# EAGLE design ROB (EAGLE 9.6.2)
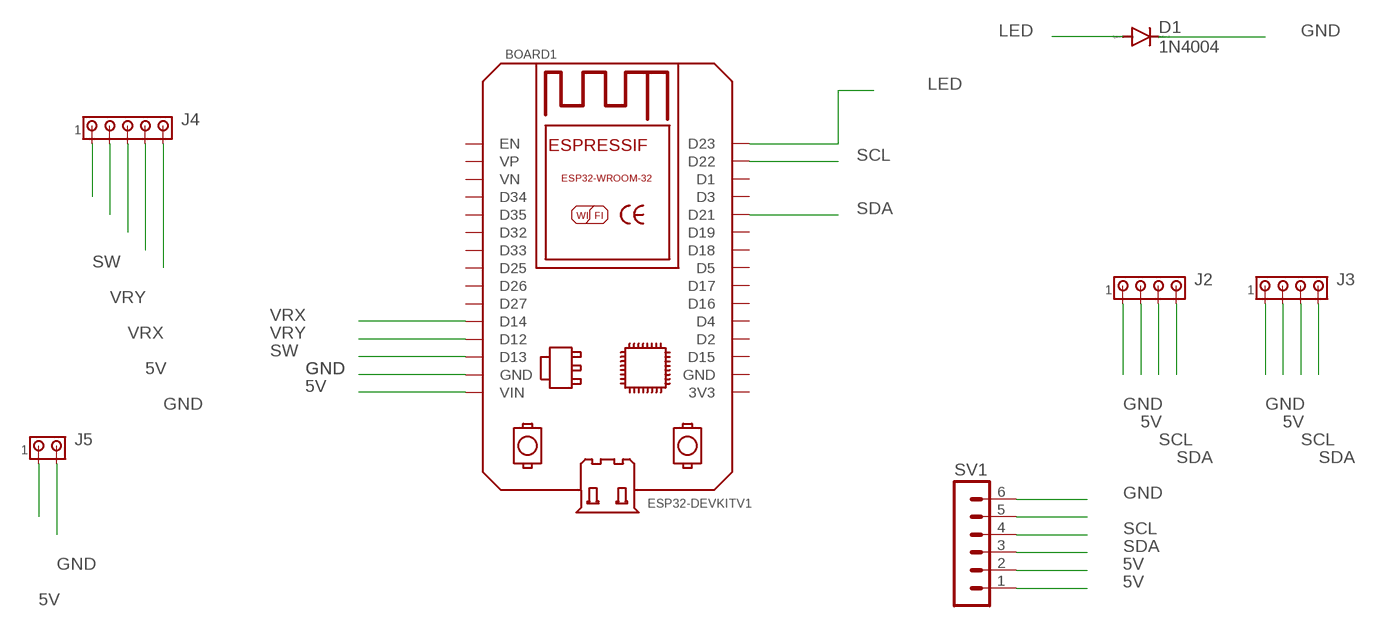
[diagram p0: schematic, sheet 1]

## Parts
BOARD1  ESP32DEVKITV1  [ESP32-DEVKITV1]
D1  1N4004  [DO41-10]
J2  MTA04-100  [10X04MTA]
J3  MTA04-100  [10X04MTA]
J4  MTA05-100  [10X05MTA]
J5  MTA02-156  [1X2MTA]
SV1  MA06-1  [MA06-1]

## Nets
5V: BOARD1.VIN J2.2 J3.2 J4.4 J5.1 SV1.1 SV1.2
GND: BOARD1.GND D1.C J2.1 J3.1 J4.5 J5.2 SV1.6
LED: BOARD1.D23 D1.A
N$2: SV1.5
SCL: BOARD1.D22 J2.3 J3.3 SV1.4
SDA: BOARD1.D21 J2.4 J3.4 SV1.3
SW: BOARD1.D13 J4.1
VRX: BOARD1.D14 J4.3
VRY: BOARD1.D12 J4.2
Unconnected: BOARD1.3V3 BOARD1.D1 BOARD1.D2 BOARD1.D3 BOARD1.D4 BOARD1.D5 BOARD1.D15 BOARD1.D16 BOARD1.D17 BOARD1.D18 BOARD1.D19 BOARD1.D25 BOARD1.D26 BOARD1.D27 BOARD1.D32 BOARD1.D33 BOARD1.D34 BOARD1.D35 BOARD1.EN BOARD1.GND@1(GND) BOARD1.VN BOARD1.VP

## Library data of the parts
BOARD1 = ESP32-DEVKITV1:ESP32DEVKITV1: https://github.com/shridattdudhat
D1 = diode:1N4004: DIODE general purpose rectifier, 1 A
J2 J3 = con-amp:MTA04-100: AMP connector
J4 = con-amp:MTA05-100: AMP connector
J5 = con-amp:MTA02-156: AMP connector
SV1 = con-lstb:MA06-1: PIN HEADER; OC_FARNELL: unknown; OC_NEWARK: unknown

## Board
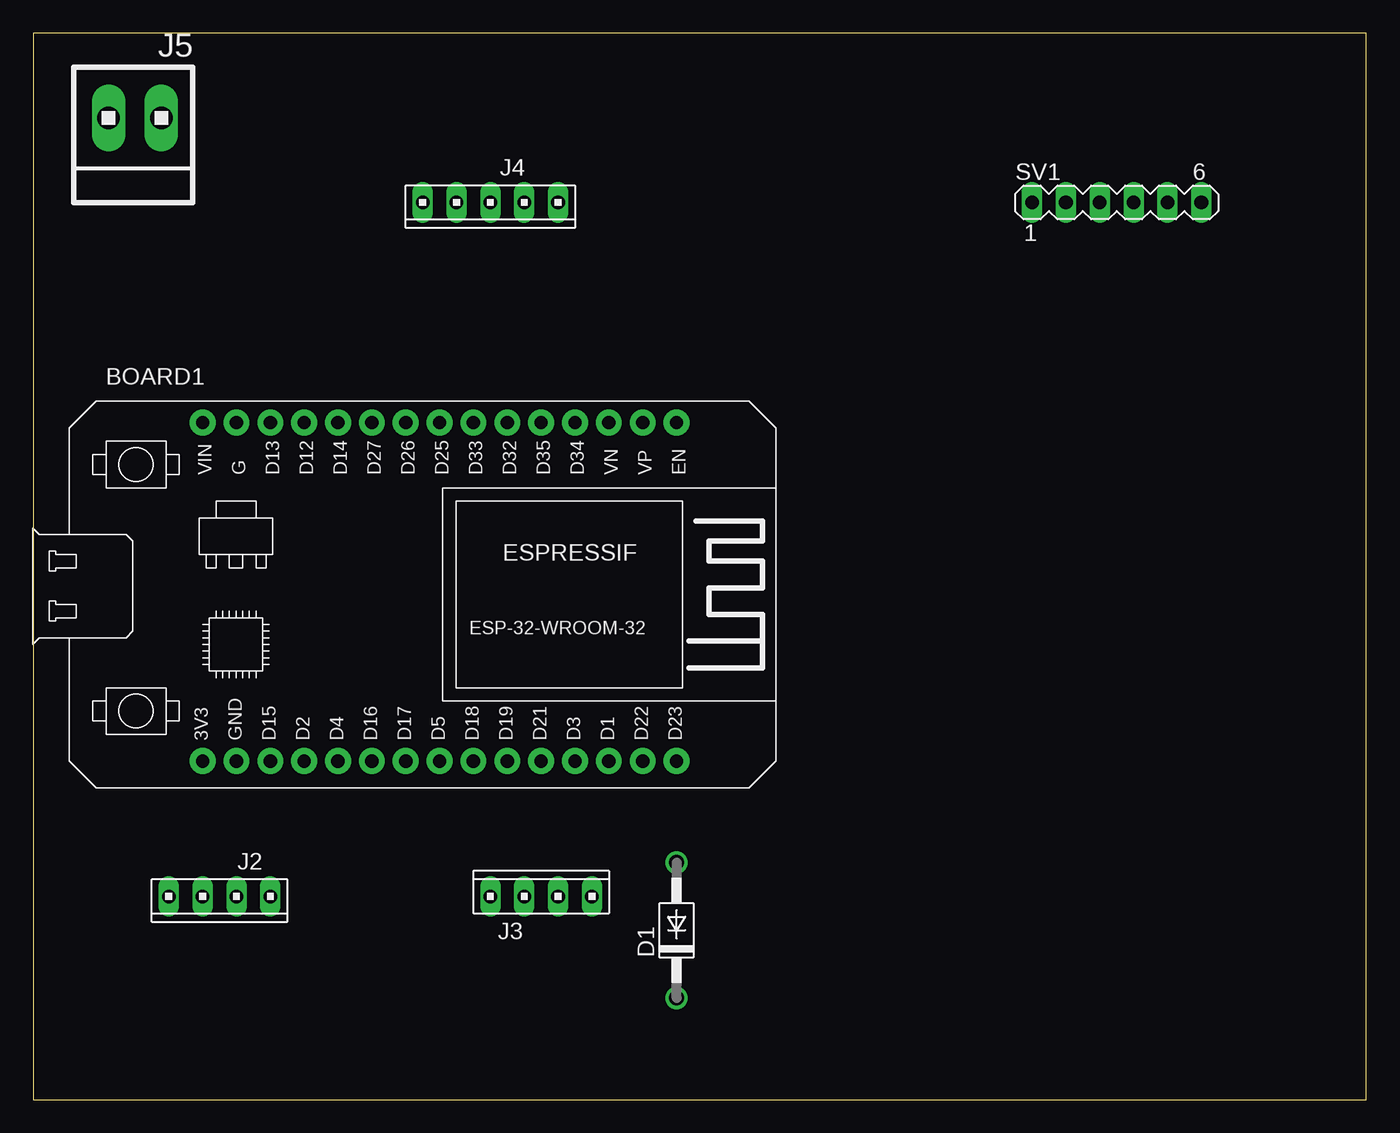
[diagram p1: board, top side]
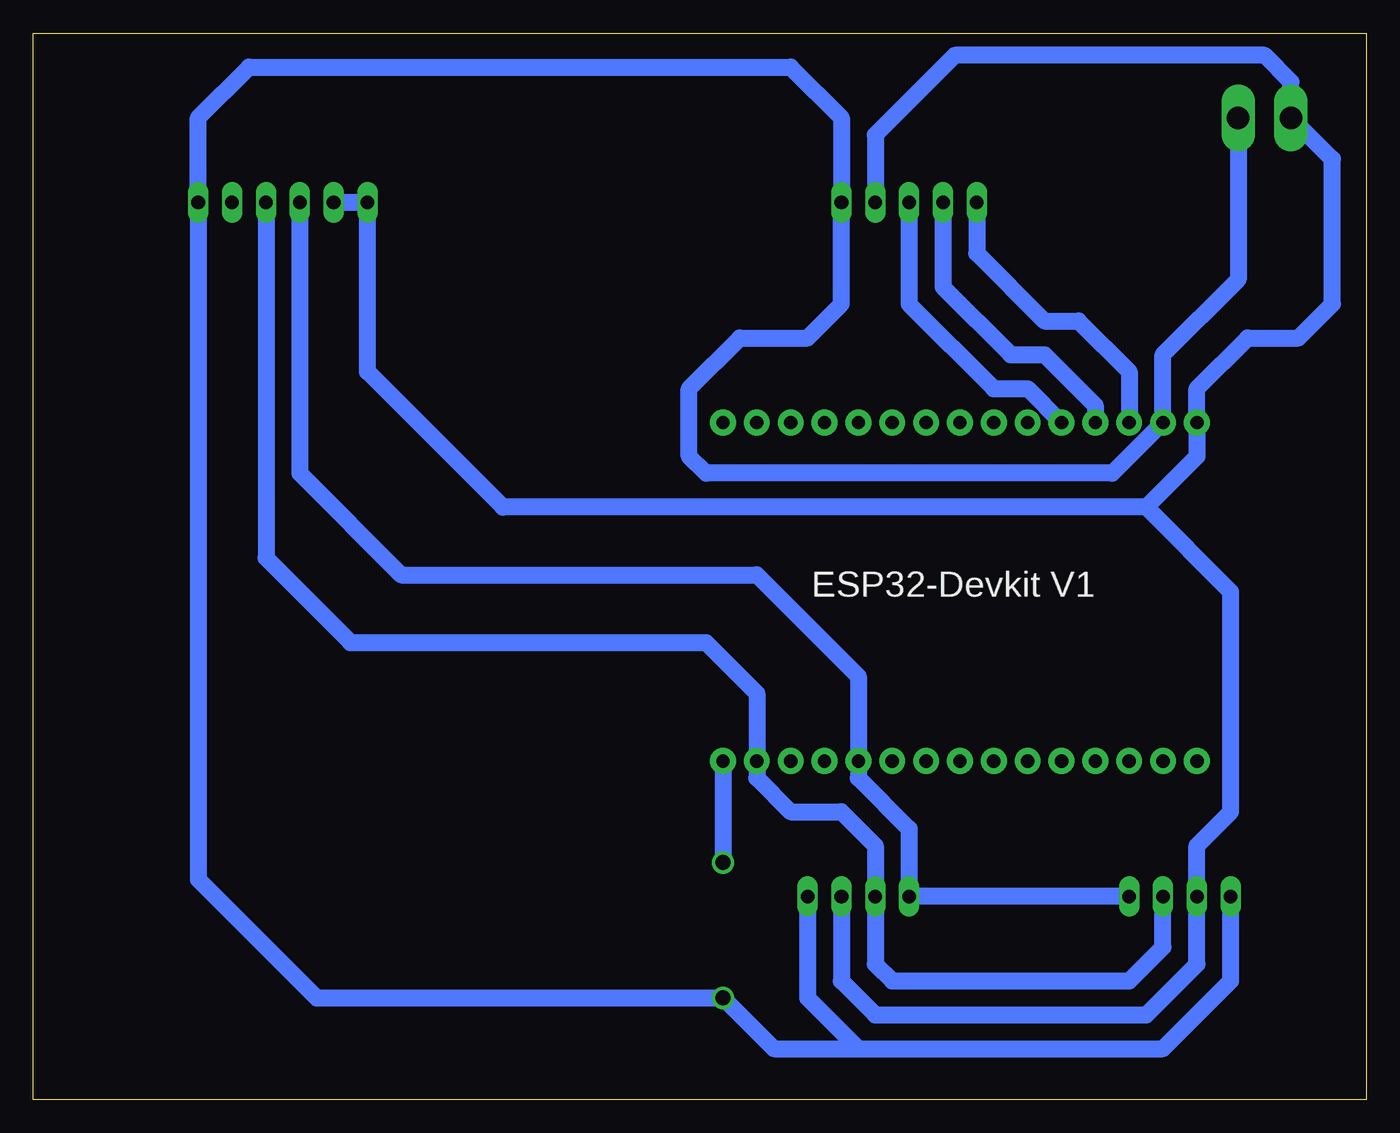
[diagram p2: board, bottom side, seen from below]

Size 100 x 80 mm. Coordinates in mm from the lower left corner, seen from the top.
Outline: 0,0 100,0 100,80 0,80 0,0
Copper layers (1*16): Top 0.035mm / dielectric 1.5mm / Bottom 0.035mm
Design rules "default": minimum track width 6mil, minimum drill 0.35mm, track to track 6mil, track to pad 6mil, pad to pad 6mil, via to via 6mil, smd to smd 6mil, copper to edge 40mil, drill to drill 6mil, minimum pad ring 10mil, minimum via ring 8mil, stop-mask expansion 4mil, vias tented up to drill 0mil, thermal gap 10mil

### Footprints (pad centres in the part's own frame; a part is rotated, then mirrored left to right if it is on the bottom)
ESP32-DEVKITV1 = drill 1 pad 1.93: 3V3 0,0; D1 30.48,0; D2 7.62,0; D3 27.94,0; D4 10.16,0; D5 17.78,0; D12 7.62,25.4; D13 5.08,25.4; D14 10.16,25.4; D15 5.08,0; D16 12.7,0; D17 15.24,0; D18 20.32,0; D19 22.86,0; D21 25.4,0; D22 33.02,0; D23 35.56,0; D25 17.78,25.4; D26 15.24,25.4; D27 12.7,25.4; D32 22.86,25.4; D33 20.32,25.4; D34 27.94,25.4; D35 25.4,25.4; EN 35.56,25.4; GND 2.54,25.4; GND@1 2.54,0; VIN 0,25.4; VN 30.48,25.4; VP 33.02,25.4
DO41-10 = drill 1.118: A 5.08,0; C -5.08,0
10X04MTA = drill 1.016 long: 1 3.81,0; 2 1.27,0; 3 -1.27,0; 4 -3.81,0
10X05MTA = drill 1.016 long: 1 5.08,0; 2 2.54,0; 3 0,0; 4 -2.54,0; 5 -5.08,0
1X2MTA = drill 1.676 long: 1 1.981,0; 2 -1.981,0
MA06-1 = drill 1.016 long: 1 -6.35,0; 2 -3.81,0; 3 -1.27,0; 4 1.27,0; 5 3.81,0; 6 6.35,0

### Placement (x,y rotation side)
BOARD1  12.7,25.4 0 top
D1  48.26,12.7 90 top
J2  13.97,15.24 180 top
J3  38.1,15.24 0 top
J4  34.29,67.31 180 top
J5  7.62,73.66 180 top
SV1  81.28,67.31 0 top

### Tracks (layer width: path | path; a pad name or v marks a point on that pad's centre or on a via)
5V
  Bottom 1.27: J4.4 36.83,72.39 30.87,78.35 7.62,78.35 5.64,76.37 J5.1 2.54,70.56 2.54,59.69 5.08,57.15 8.89,57.15 12.7,53.34 BOARD1.VIN 12.7,48.26 16.51,44.45 | 16.51,44.45 64.77,44.45 74.93,54.61 SV1.1 SV1.2 | 16.51,44.45 10.16,38.1 10.16,21.59 12.7,19.05 J2.2 12.7,10.16 16.51,6.35 36.83,6.35 39.37,8.89 J3.2
GND
  Bottom 1.27: J5.2 9.6,61.52 15.24,55.88 BOARD1.GND 19.05,46.99 49.53,46.99 50.8,48.26 50.8,53.34 46.99,57.15 41.91,57.15 39.37,59.69 J4.5 39.37,73.66 43.18,77.47 83.82,77.47 87.63,73.66 SV1.6 87.63,16.51 78.74,7.62 D1.C 44.45,3.81 38.1,3.81 | J3.1 41.91,7.62 38.1,3.81 | 38.1,3.81 15.24,3.81 10.16,8.89 J2.1
LED
  Bottom 1.27: BOARD1.D23 D1.A
SCL
  Bottom 1.27: J2.3 15.24,11.43 17.78,8.89 35.56,8.89 36.83,10.16 J3.3 36.83,19.05 39.37,21.59 43.18,21.59 45.72,24.13 BOARD1.D22 45.72,30.48 49.53,34.29 76.2,34.29 82.55,40.64 SV1.4
SDA
  Bottom 1.27: J2.4 J3.4 34.29,20.32 38.1,24.13 BOARD1.D21 38.1,31.75 45.72,39.37 72.39,39.37 80.01,46.99 SV1.3
SW
  Bottom 1.27: J4.1 29.21,63.5 24.13,58.42 21.59,58.42 17.78,54.61 BOARD1.D13
VRX
  Bottom 1.27: J4.3 34.29,59.69 27.94,53.34 25.4,53.34 BOARD1.D14
VRY
  Bottom 1.27: BOARD1.D12 20.32,52.07 24.13,55.88 26.67,55.88 31.75,60.96 J4.2